# EasyEDA schematic SCH_n2_pdb_v4_2022-03-22.json
TITLE: PDB_v4; REV: 1.0; Date: 2022-03-21; Sheet: 1/1; Drawn By: cmucheru; Company: Nakuja project
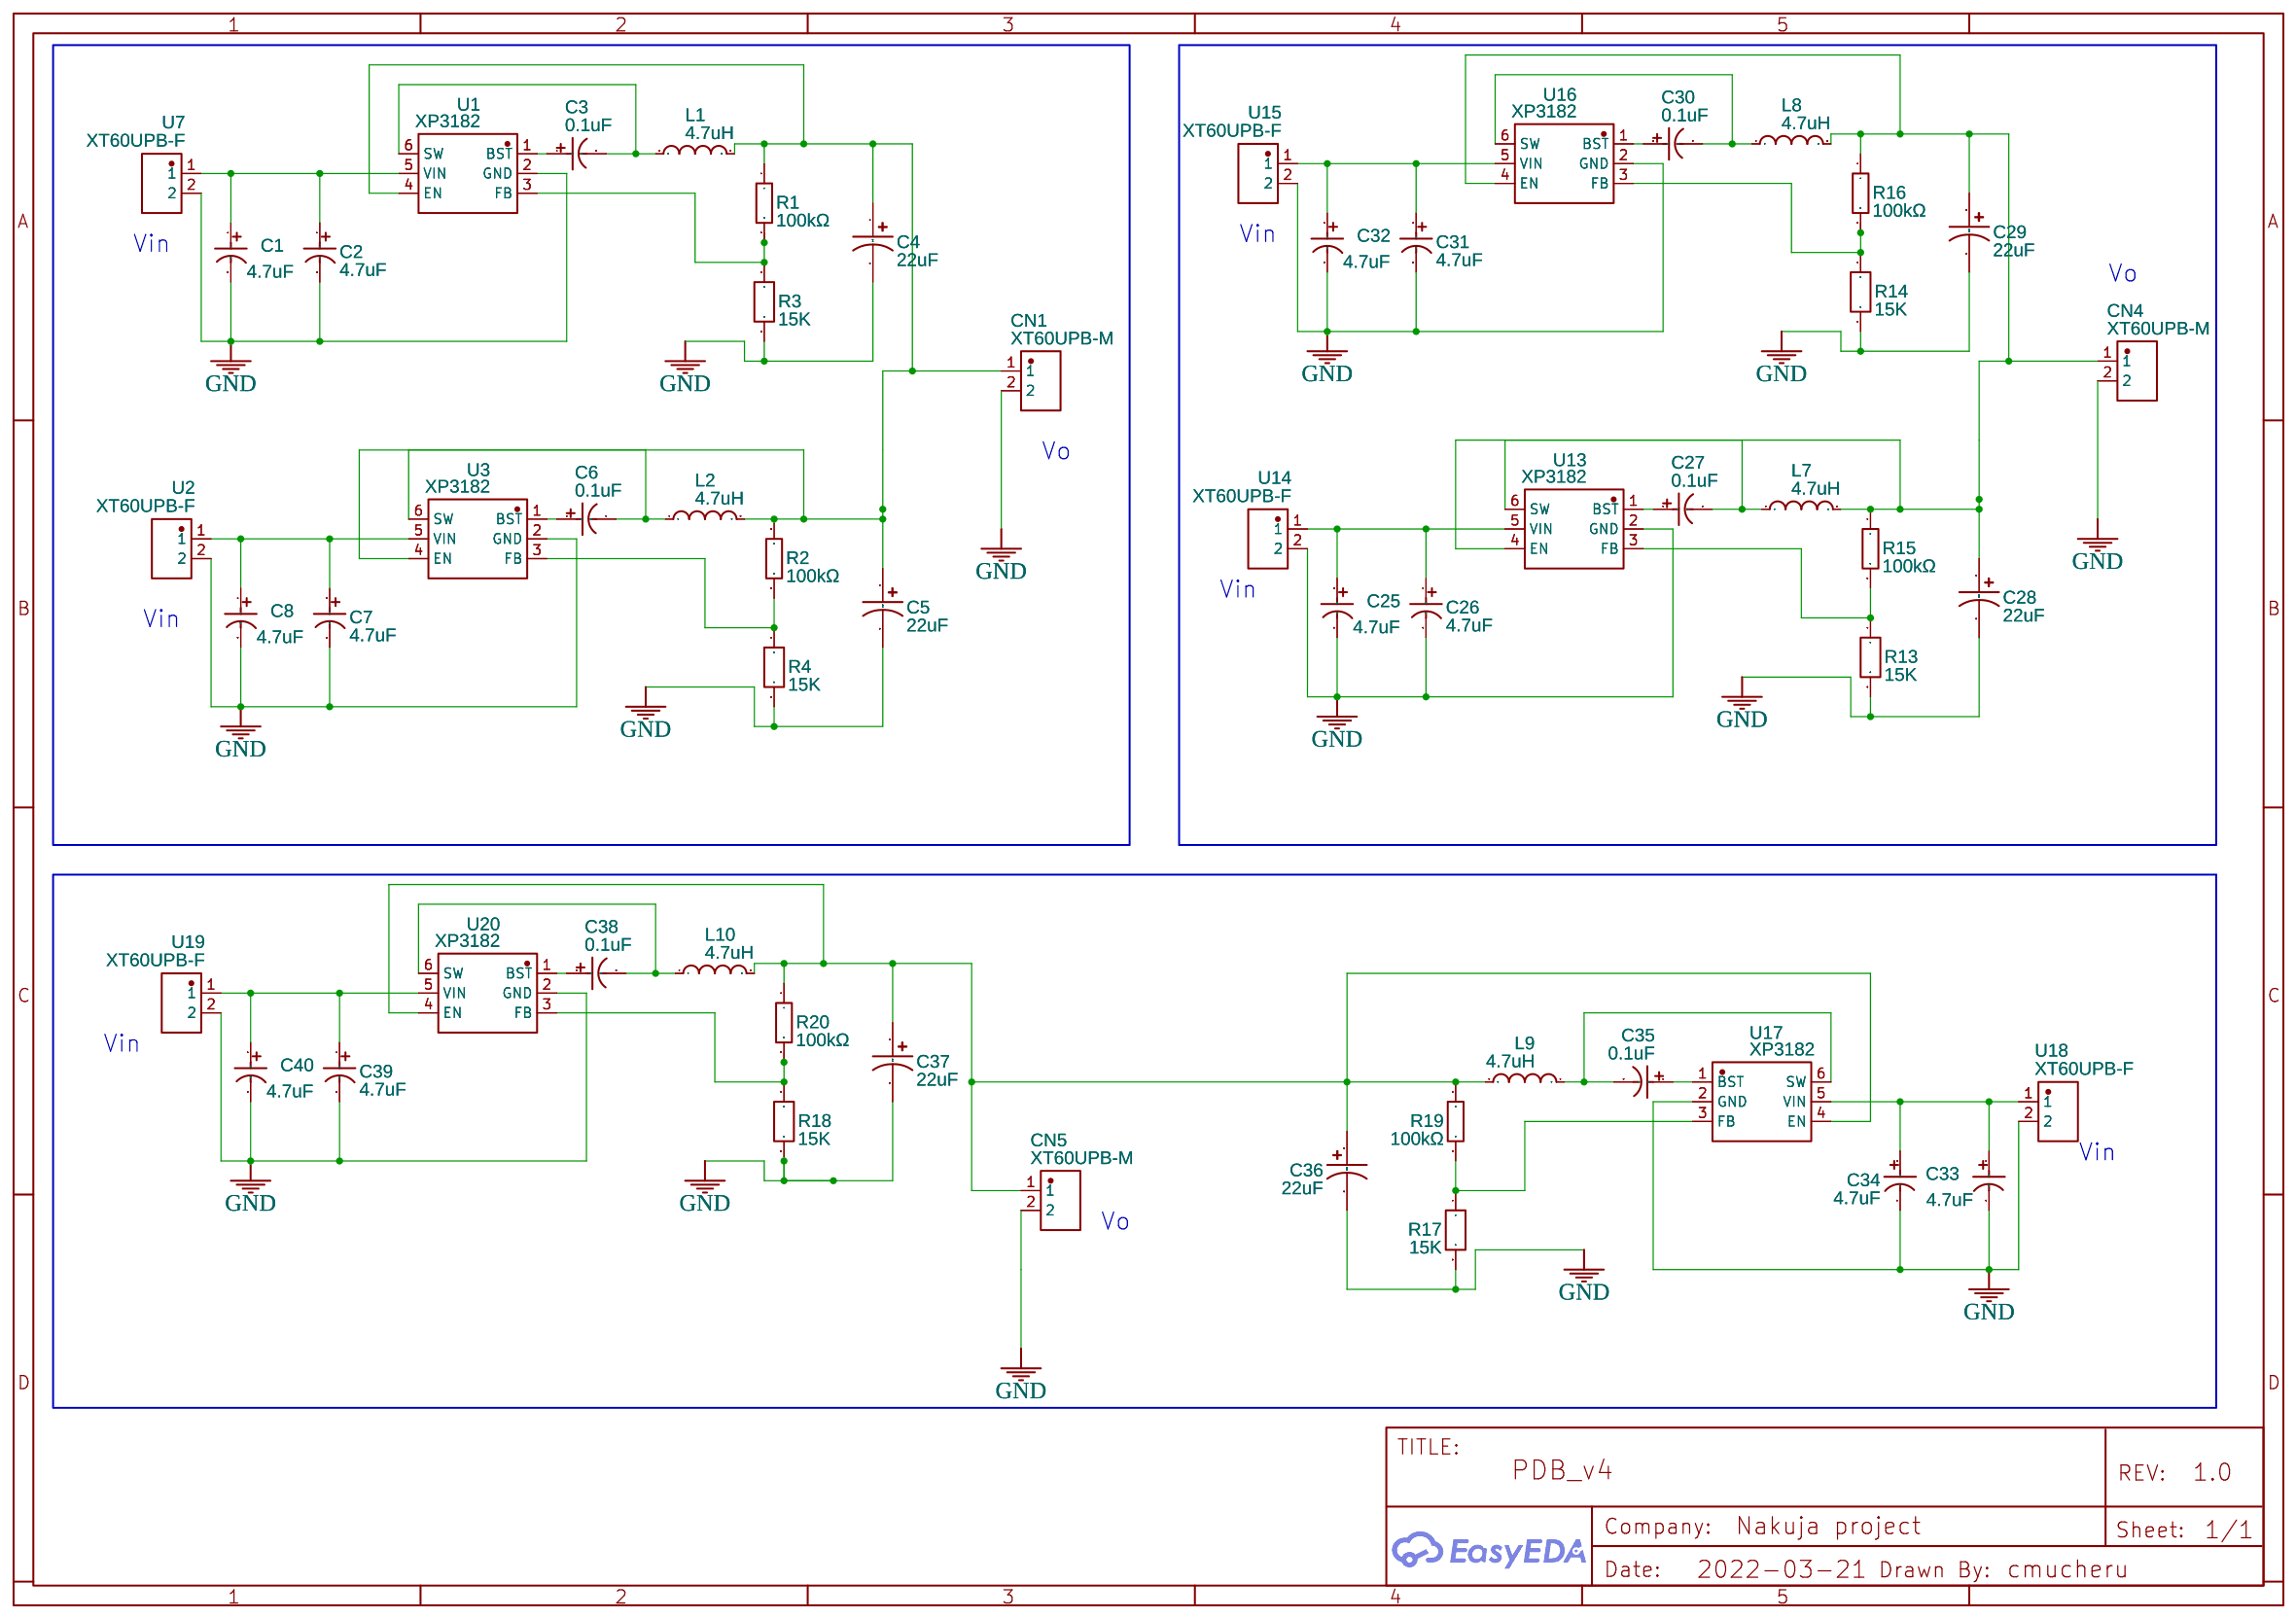
[diagram p0: schematic sheet]

## Parts
C1  4.7uF  [CAP-TH_BD8.0-P3.50-D0.6-FD]
C2  4.7uF  [CAP-TH_BD8.0-P3.50-D0.6-FD]
C3  0.1uF  [CAP-TH_BD4.0-P1.50-D0.8-FD]
C4  22uF  [CAP-TH_BD12.5-P5.00-D0.6-FD]
C5  22uF  [CAP-TH_BD12.5-P5.00-D0.6-FD]
C6  0.1uF  [CAP-TH_BD4.0-P1.50-D0.8-FD]
C7  4.7uF  [CAP-TH_BD8.0-P3.50-D0.6-FD]
C8  4.7uF  [CAP-TH_BD8.0-P3.50-D0.6-FD]
C25  4.7uF  [CAP-TH_BD8.0-P3.50-D0.6-FD]
C26  4.7uF  [CAP-TH_BD8.0-P3.50-D0.6-FD]
C27  0.1uF  [CAP-TH_BD4.0-P1.50-D0.8-FD]
C28  22uF  [CAP-TH_BD12.5-P5.00-D0.6-FD]
C29  22uF  [CAP-TH_BD12.5-P5.00-D0.6-FD]
C30  0.1uF  [CAP-TH_BD4.0-P1.50-D0.8-FD]
C31  4.7uF  [CAP-TH_BD8.0-P3.50-D0.6-FD]
C32  4.7uF  [CAP-TH_BD8.0-P3.50-D0.6-FD]
C33  4.7uF  [CAP-TH_BD8.0-P3.50-D0.6-FD]
C34  4.7uF  [CAP-TH_BD8.0-P3.50-D0.6-FD]
C35  0.1uF  [CAP-TH_BD4.0-P1.50-D0.8-FD]
C36  22uF  [CAP-TH_BD12.5-P5.00-D0.6-FD]
C37  22uF  [CAP-TH_BD12.5-P5.00-D0.6-FD]
C38  0.1uF  [CAP-TH_BD4.0-P1.50-D0.8-FD]
C39  4.7uF  [CAP-TH_BD8.0-P3.50-D0.6-FD]
C40  4.7uF  [CAP-TH_BD8.0-P3.50-D0.6-FD]
CN1  XT60UPB-M  [CONN-TH_XT60UPB-M]
CN4  XT60UPB-M  [CONN-TH_XT60UPB-M]
CN5  XT60UPB-M  [CONN-TH_XT60UPB-M]
L1  4.7uH  [IND-SMD_L5.2-W5.2_YSPI0530]
L2  4.7uH  [IND-SMD_L5.2-W5.2_YSPI0530]
L7  4.7uH  [IND-SMD_L5.2-W5.2_YSPI0530]
L8  4.7uH  [IND-SMD_L5.2-W5.2_YSPI0530]
L9  4.7uH  [IND-SMD_L5.2-W5.2_YSPI0530]
L10  4.7uH  [IND-SMD_L5.2-W5.2_YSPI0530]
R1  100kΩ  [R0402]
R2  100kΩ  [R0402]
R3  15K  [R0805]
R4  15K  [R0805]
R13  15K  [R0805]
R14  15K  [R0805]
R15  100kΩ  [R0402]
R16  100kΩ  [R0402]
R17  15K  [R0805]
R18  15K  [R0805]
R19  100kΩ  [R0402]
R20  100kΩ  [R0402]
U1  XP3182  [SOT-23-6_L2.9-W1.6-P0.95-LS2.8-BL]
U2  XT60UPB-F  [CONN-TH_XT60UPB-F]
U3  XP3182  [SOT-23-6_L2.9-W1.6-P0.95-LS2.8-BL]
U7  XT60UPB-F  [CONN-TH_XT60UPB-F]
U13  XP3182  [SOT-23-6_L2.9-W1.6-P0.95-LS2.8-BL]
U14  XT60UPB-F  [CONN-TH_XT60UPB-F]
U15  XT60UPB-F  [CONN-TH_XT60UPB-F]
U16  XP3182  [SOT-23-6_L2.9-W1.6-P0.95-LS2.8-BL]
U17  XP3182  [SOT-23-6_L2.9-W1.6-P0.95-LS2.8-BL]
U18  XT60UPB-F  [CONN-TH_XT60UPB-F]
U19  XT60UPB-F  [CONN-TH_XT60UPB-F]
U20  XP3182  [SOT-23-6_L2.9-W1.6-P0.95-LS2.8-BL]

## Library data of the parts
C1 C2 C7 C8 C25 C26 C31-C34 C39 C40 = ERK2GM4R7F09OT: Supplier: LCSC; Manufacturer: AISHI; Supplier Part: C112499; JLCPCB Part Class: Extended Part
C3 C6 C27 C30 C35 C38 = 0.1uF 50V 4*5 Black high frequency: Supplier: LCSC; Manufacturer: ValuePro; Supplier Part: C45093; JLCPCB Part Class: Extended Part
C4 C5 C28 C29 C36 C37 = 400AX22MEFC12.5X16: Supplier: LCSC; Supplier Part: C473193; Manufacturer: Rubycon; Contributor: LCSC; JLCPCB Part Class: Extended Part
CN1 CN4 CN5 = XT60UPB-M: Supplier: LCSC; Supplier Part: C2918078; JLCPCB Part Class: Extended Part; Contributor: LCSC
L1 L2 L7-L10 = MCS0530-4R7MN2: Supplier: LCSC; Supplier Part: C2836880; Manufacturer: PSA(信昌电陶); Contributor: LCSC; JLCPCB Part Class: Extended Part
R1 R2 R15 R16 R19 R20 = AR02BTD1003: Supplier: LCSC; Supplier Part: C319965; Manufacturer: Viking Tech; Resistance (Ohms): 100K; Contributor: LCSC; JLCPCB Part Class: Extended Part
R3 R4 R13 R14 R17 R18 = TC0525D1502T5E_C44536: Supplier: LCSC; Supplier Part: C44536; Manufacturer: Uniroyal Elec; Manufacturer Part: TC0525D1502T5E; Contributor: LCSC; JLCPCB Part Class: Extended Part
U1 U3 U13 U16 U17 U20 = XP3182: Supplier: LCSC; Supplier Part: C2802261; Manufacturer: FM富满; Contributor: LCSC; JLCPCB Part Class: Extended Part
U2 U7 U14 U15 U18 U19 = XT60UPB-F: Supplier: LCSC; Supplier Part: C9900007500; Manufacturer: null; Contributor: LCSC; JLCPCB Part Class: Extended Part

## Nets
GND: C1.2 C2.2 C4.2 C5.2 C7.2 C8.2 C25.2 C26.2 C28.2 C29.2 C31.2 C32.2 C33.2 C34.2 C36.2 C37.2 C39.2 C40.2 CN1.2 CN4.2 CN5.2 R3.2 R4.2 R13.2 R14.2 R17.2 R18.2 U1.2(GND) U2.2 U3.2(GND) U7.2 U13.2(GND) U14.2 U15.2 U16.2(GND) U17.2(GND) U18.2 U19.2 U20.2(GND)
Net-(C1-1): C1.1 C2.1 U1.5(VIN) U7.1
Net-(C3-1): C3.1 U1.1(BST)
Net-(C3-2): C3.2 L1.1 U1.6(SW)
Net-(C4-1): C4.1 C5.1 CN1.1 L1.2 L2.2 R1.1 R2.1 U1.4(EN) U3.4(EN)
Net-(C6-1): C6.1 U3.1(BST)
Net-(C6-2): C6.2 L2.1 U3.6(SW)
Net-(C7-1): C7.1 C8.1 U2.1 U3.5(VIN)
Net-(C25-1): C25.1 C26.1 U13.5(VIN) U14.1
Net-(C27-1): C27.1 U13.1(BST)
Net-(C27-2): C27.2 L7.1 U13.6(SW)
Net-(C28-1): C28.1 C29.1 CN4.1 L7.2 L8.2 R15.1 R16.1 U13.4(EN) U16.4(EN)
Net-(C30-1): C30.1 U16.1(BST)
Net-(C30-2): C30.2 L8.1 U16.6(SW)
Net-(C31-1): C31.1 C32.1 U15.1 U16.5(VIN)
Net-(C33-1): C33.1 C34.1 U17.5(VIN) U18.1
Net-(C35-1): C35.1 U17.1(BST)
Net-(C35-2): C35.2 L9.1 U17.6(SW)
Net-(C36-1): C36.1 C37.1 CN5.1 L9.2 L10.2 R19.1 R20.1 U17.4(EN) U20.4(EN)
Net-(C38-1): C38.1 U20.1(BST)
Net-(C38-2): C38.2 L10.1 U20.6(SW)
Net-(C39-1): C39.1 C40.1 U19.1 U20.5(VIN)
Net-(R1-2): R1.2 R3.1 U1.3(FB)
Net-(R2-2): R2.2 R4.1 U3.3(FB)
Net-(R13-1): R13.1 R15.2 U13.3(FB)
Net-(R14-1): R14.1 R16.2 U16.3(FB)
Net-(R17-1): R17.1 R19.2 U17.3(FB)
Net-(R18-1): R18.1 R20.2 U20.3(FB)

## Notes on the sheet
- Vin
- Vin
- Vo
- Vo
- Vin
- Vin
- Vin
- Vin
- Vo
